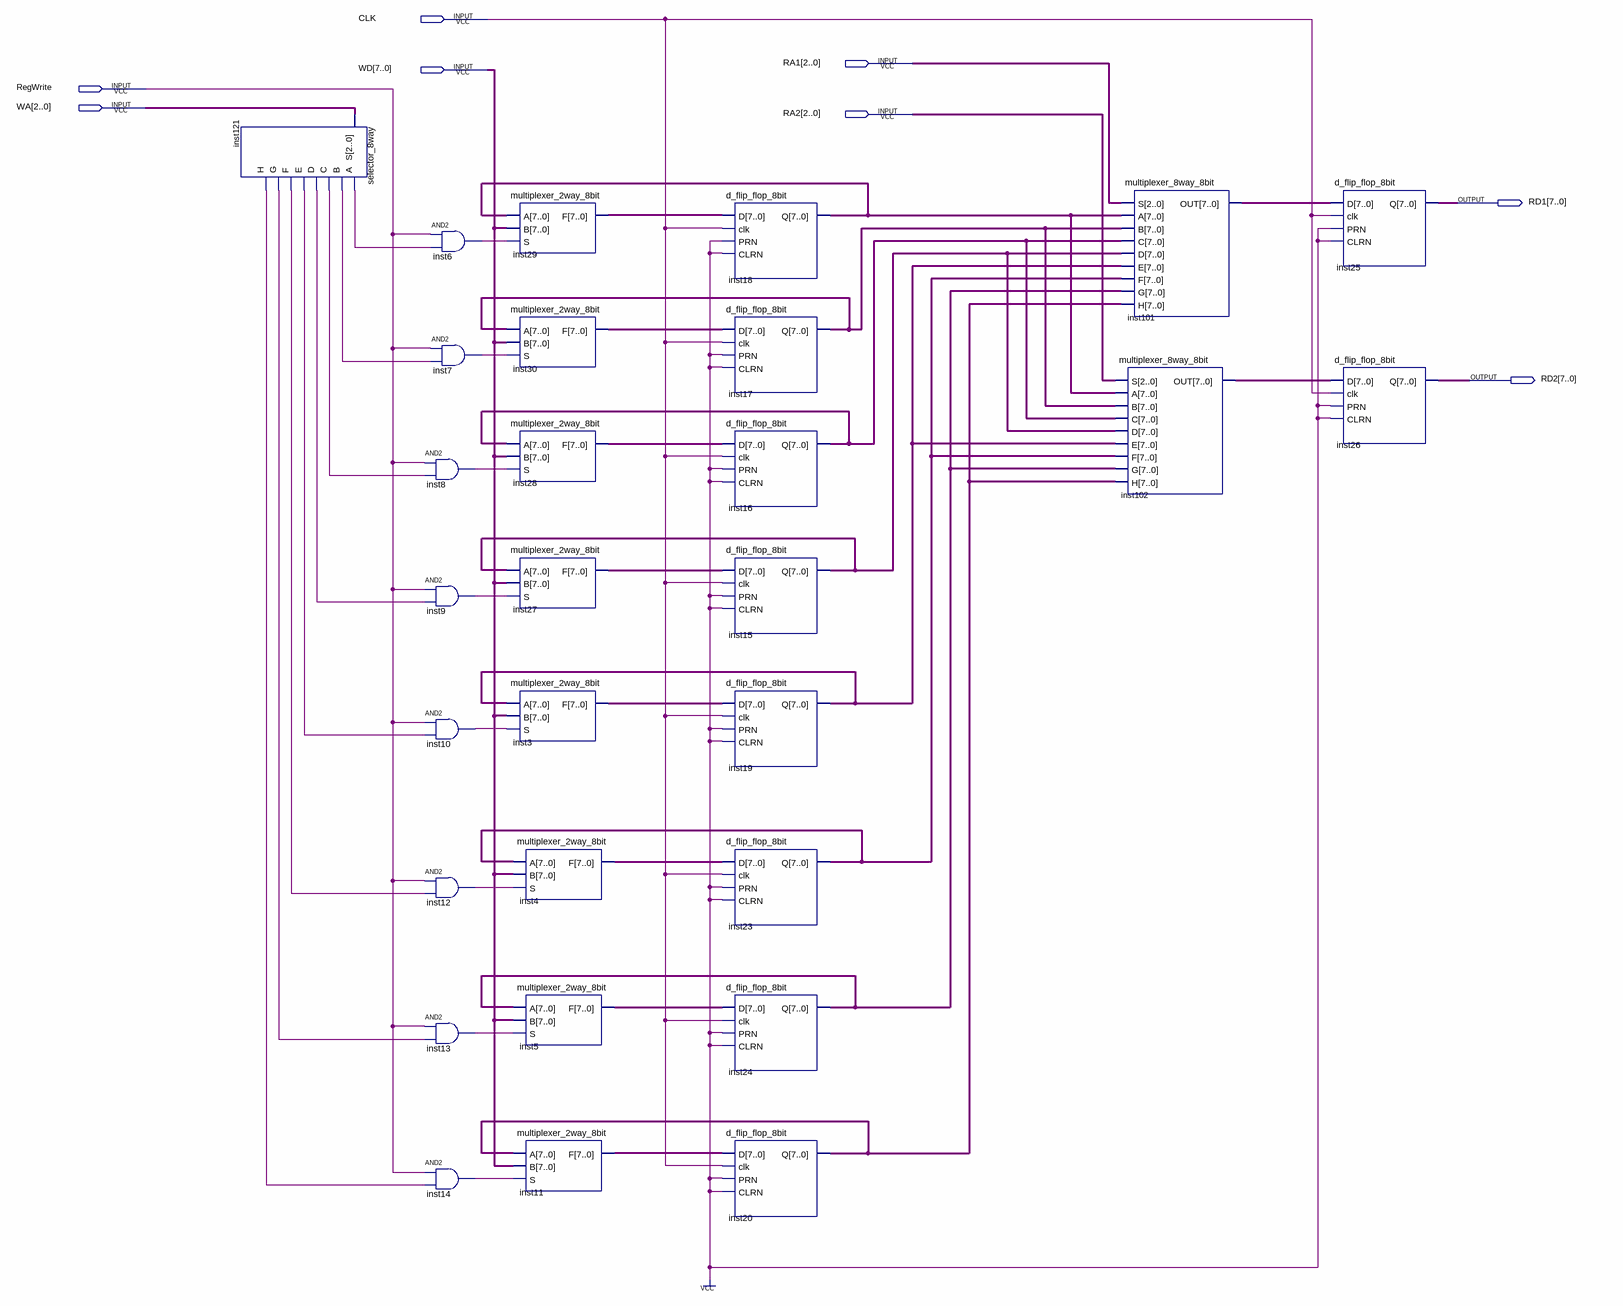
[diagram p0: schematic sheet]
// Quartus schematic register_file_8bit_8reg.bdf as structural Verilog: 29 symbols, 8 pins
module register_file_8bit_8reg (
  input  CLK,
  input  [2:0] RA1,
  input  [7:0] WD,
  input  RegWrite,
  input  [2:0] WA,
  input  [2:0] RA2,
  output [7:0] RD1,
  output [7:0] RD2
);

  wire inst6_out, inst7_out, inst8_out, inst9_out, inst10_out, inst12_out, inst13_out, inst14_out, inst121_a,
       inst121_b, inst121_c, inst121_d, inst121_e, inst121_f, inst121_g, inst121_h;
  wire [7:0] inst3_f, inst4_f, inst5_f, inst11_f, inst15_q, inst16_q, inst17_q, inst18_q, inst19_q, inst20_q,
       inst23_q, inst24_q, inst27_f, inst28_f, inst29_f, inst30_f, inst101_out, inst102_out;

  selector_8way inst121 (
    .S(WA), .A(inst121_a), .B(inst121_b), .C(inst121_c), .D(inst121_d), .E(inst121_e), .F(inst121_f),
    .G(inst121_g), .H(inst121_h));
  and inst6 (inst6_out, RegWrite, inst121_a);
  and inst7 (inst7_out, RegWrite, inst121_b);
  and inst8 (inst8_out, RegWrite, inst121_c);
  and inst9 (inst9_out, RegWrite, inst121_d);
  and inst10 (inst10_out, RegWrite, inst121_e);
  and inst12 (inst12_out, RegWrite, inst121_f);
  and inst13 (inst13_out, RegWrite, inst121_g);
  and inst14 (inst14_out, RegWrite, inst121_h);
  multiplexer_2way_8bit inst29 (.A(inst18_q), .B(WD), .S(inst6_out), .F(inst29_f));
  multiplexer_2way_8bit inst30 (.A(inst17_q), .B(WD), .S(inst7_out), .F(inst30_f));
  multiplexer_2way_8bit inst28 (.A(inst16_q), .B(WD), .S(inst8_out), .F(inst28_f));
  multiplexer_2way_8bit inst27 (.A(inst15_q), .B(WD), .S(inst9_out), .F(inst27_f));
  multiplexer_2way_8bit inst3 (.A(inst19_q), .B(WD), .S(inst10_out), .F(inst3_f));
  multiplexer_2way_8bit inst4 (.A(inst23_q), .B(WD), .S(inst12_out), .F(inst4_f));
  multiplexer_2way_8bit inst5 (.A(inst24_q), .B(WD), .S(inst13_out), .F(inst5_f));
  multiplexer_2way_8bit inst11 (.A(inst20_q), .B(WD), .S(inst14_out), .F(inst11_f));
  d_flip_flop_8bit inst18 (.D(inst29_f), .clk(CLK), .PRN(1'b1), .CLRN(1'b1), .Q(inst18_q));
  d_flip_flop_8bit inst17 (.D(inst30_f), .clk(CLK), .PRN(1'b1), .CLRN(1'b1), .Q(inst17_q));
  d_flip_flop_8bit inst16 (.D(inst28_f), .clk(CLK), .PRN(1'b1), .CLRN(1'b1), .Q(inst16_q));
  d_flip_flop_8bit inst15 (.D(inst27_f), .clk(CLK), .PRN(1'b1), .CLRN(1'b1), .Q(inst15_q));
  d_flip_flop_8bit inst19 (.D(inst3_f), .clk(CLK), .PRN(1'b1), .CLRN(1'b1), .Q(inst19_q));
  d_flip_flop_8bit inst23 (.D(inst4_f), .clk(CLK), .PRN(1'b1), .CLRN(1'b1), .Q(inst23_q));
  d_flip_flop_8bit inst24 (.D(inst5_f), .clk(CLK), .PRN(1'b1), .CLRN(1'b1), .Q(inst24_q));
  d_flip_flop_8bit inst20 (.D(inst11_f), .clk(CLK), .PRN(1'b1), .CLRN(1'b1), .Q(inst20_q));
  multiplexer_8way_8bit inst101 (
    .S(RA1), .A(inst18_q), .B(inst17_q), .C(inst16_q), .D(inst15_q), .E(inst19_q), .F(inst23_q),
    .G(inst24_q), .H(inst20_q), .OUT(inst101_out));
  multiplexer_8way_8bit inst102 (
    .S(RA2), .A(inst18_q), .B(inst17_q), .C(inst16_q), .D(inst15_q), .E(inst19_q), .F(inst23_q),
    .G(inst24_q), .H(inst20_q), .OUT(inst102_out));
  d_flip_flop_8bit inst25 (.D(inst101_out), .clk(CLK), .PRN(1'b1), .CLRN(1'b1), .Q(RD1));
  d_flip_flop_8bit inst26 (.D(inst102_out), .clk(CLK), .PRN(1'b1), .CLRN(1'b1), .Q(RD2));
endmodule
